# Altium schematic sheet 主控电路.SchDoc
size A4
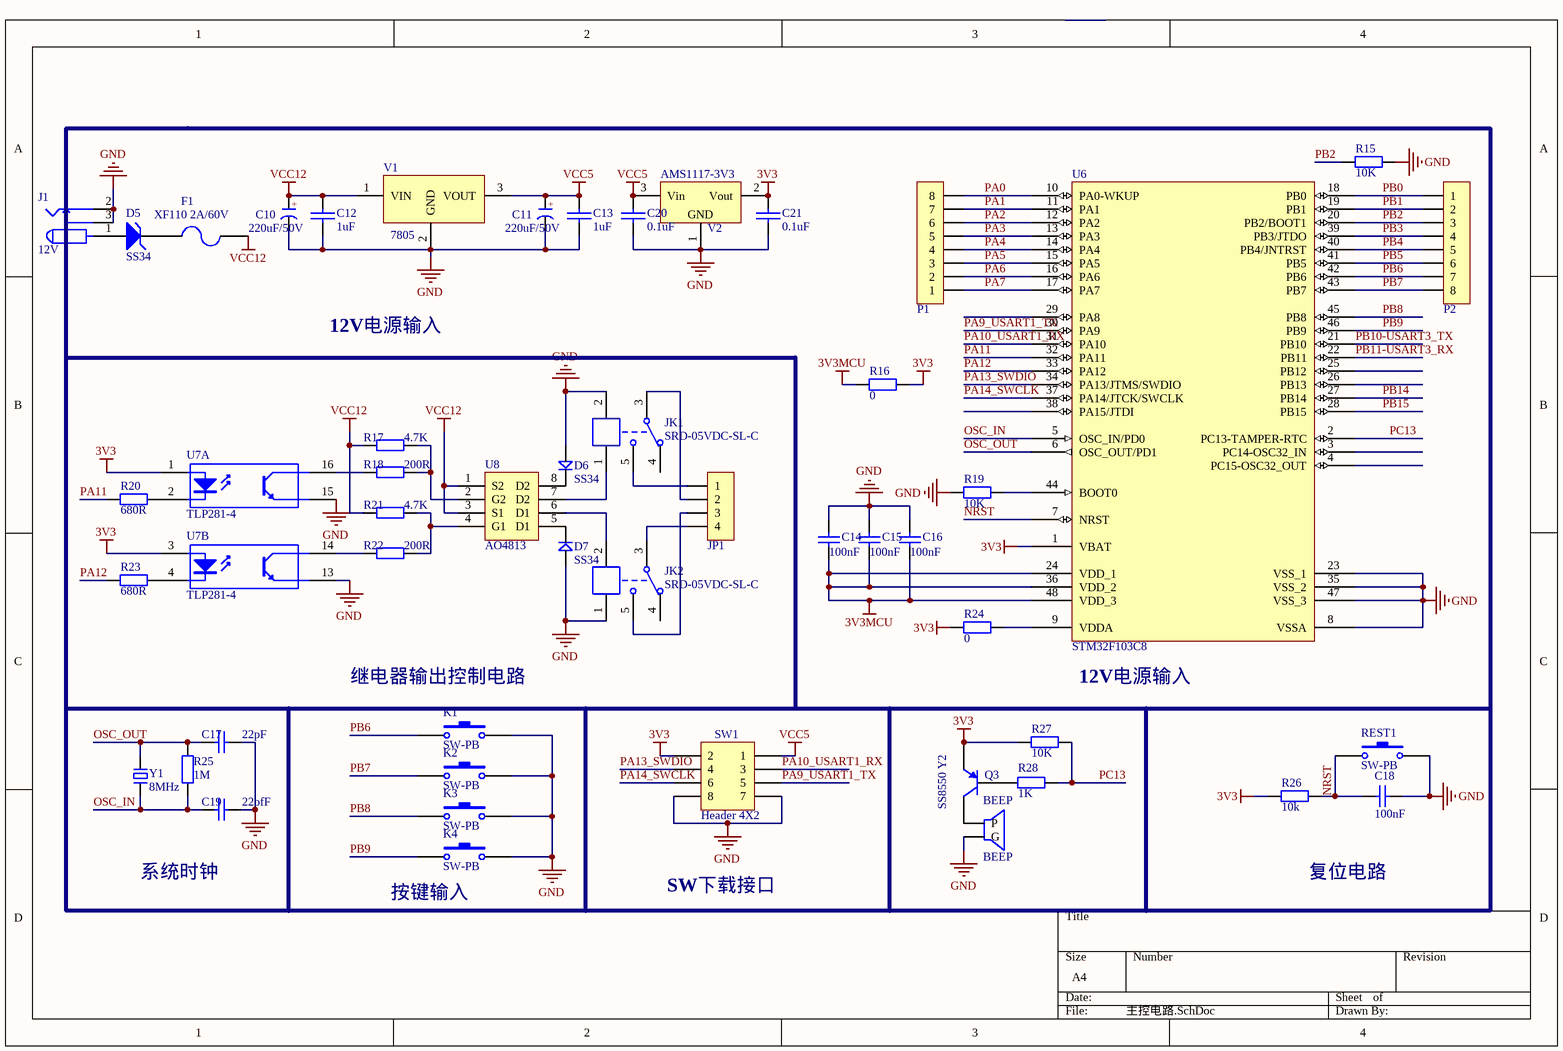
[diagram p0: 主控电路.SchDoc]

## Parts
BEEP  BEEP  [BUZZER]
C10  220uF/50V  [CAP 3.5*8*11.5 - BK]
C11  220uF/50V  [CAP 3.5*8*11.5 - BK]
C12  1uF  [LC-0603_C]
C13  1uF  [LC-0603_C]
C14  100nF  [LC-0603_C]
C15  100nF  [LC-0603_C]
C16  100nF  [LC-0603_C]
C17  22pF  [LC-0603_C]
C18  100nF  [LC-0603_C]
C19  22pfF  [LC-0603_C]
C20  0.1uF  [LC-0603_C]
C21  0.1uF  [LC-0603_C]
D5  SS34  [D1812]
D6  SS34  [D1812]
D7  SS34  [D1812]
F1  XF110 2A/60V  [FUSE1]
J1  12V  [DC10B]
JK1  SRD-05VDC-SL-C  [SRD-C_B]
JK2  SRD-05VDC-SL-C  [SRD-C_B]
JP1  HDR-1X4  [KF128-5.08-4P]  (value not drawn)
K1  SW-PB  [TSW DIP-6*6*5]
K2  SW-PB  [TSW DIP-6*6*5]
K3  SW-PB  [TSW DIP-6*6*5]
K4  SW-PB  [TSW DIP-6*6*5]
P1  HDR-1X8  [HDR2.54-LI-8P]  (value not drawn)
P2  HDR-1X8  [HDR2.54-LI-8P]  (value not drawn)
Q3  SS8550 Y2  [LC-SOT-23(SOT-23-3)]
R15  10K  [LC-0603_R]
R16  0  [LC-0603_R]
R17  4.7K  [LC-0603_R]
R18  200R  [LC-0603_R]
R19  10K  [LC-0603_R]
R20  680R  [LC-0603_R]
R21  4.7K  [LC-0603_R]
R22  200R  [LC-0603_R]
R23  680R  [LC-0603_R]
R24  0  [LC-0603_R]
R25  1M  [LC-0603_R]
R26  10k  [LC-0603_R]
R27  10K  [LC-0603_R]
R28  1K  [LC-0603_R]
REST1  SW-PB  [TSW DIP-6*6*5]
SW1  Header 4X2  [HDR2.54-LI-2x4P]
U6  STM32F103C8  [LQFP48 7X7_M]
U7  TLP281-4  [SOp-16]  (parts A,B of 4)
U8  AO4813  [SOP-8]
V1  7805  [TO220A]
V2  AMS1117-3V3  [SOT223_M]
Y1  8MHz  [OSC HC-49S]

## Nets
3V3: C21.2 Q3.2(E) R16.1 R24.2 R26.1 R27.2 SW1.2 U6.1(VBAT) U7.1(A) U7.3(A) V2.2(Vout)
3V3MCU: C14.1 C15.1 C16.1 R16.2 U6.24(VDD_1) U6.36(VDD_2) U6.48(VDD_3)
GND: BEEP.2(G) C10.2(K) C11.2(K) C12.1 C13.1 C14.2 C15.2 C16.2 C17.2 C18.2 C19.2 C20.1 C21.1 D6.1 D7.1 J1.2 J1.3 JK1.2 JK2.1 K1.2 K2.2 K3.2 K4.2 R15.2 R19.2 REST1.2 SW1.7 SW1.8 U6.8(VSSA) U6.23(VSS_1) U6.35(VSS_2) U6.47(VSS_3) U7.13(E) U7.15(E) V1.2(GND) V2.1(GND)
VCC5: C11.1(A) C13.2 C20.2 SW1.1 V1.3(VOUT) V2.3(Vin)
VCC12: C10.1(A) C12.2 F1.2 R17.2 R21.2 U8.1(S2) U8.3(S1) V1.1(VIN)
NRST: C18.1 R26.2 REST1.1 U6.7(NRST)
OSC_IN: C19.1 R25.1 U6.5(OSC_IN/PD0) Y1.1
OSC_OUT: C17.1 R25.2 U6.6(OSC_OUT/PD1) Y1.2
PA0: P1.8 U6.10(PA0-WKUP)
PA1: P1.7 U6.11(PA1)
PA2: P1.6 U6.12(PA2)
PA3: P1.5 U6.13(PA3)
PA4: P1.4 U6.14(PA4)
PA5: P1.3 U6.15(PA5)
PA6: P1.2 U6.16(PA6)
PA7: P1.1 U6.17(PA7)
PA9_USART1_TX: SW1.5 U6.30(PA9)
PA10_USART1_RX: SW1.3 U6.31(PA10)
PA11: R20.1 U6.32(PA11)
PA12: R23.1 U6.33(PA12)
PA13_SWDIO: SW1.4 U6.34(PA13/JTMS/SWDIO)
PA14_SWCLK: SW1.6 U6.37(PA14/JTCK/SWCLK)
PB0: P2.1 U6.18(PB0)
PB1: P2.2 U6.19(PB1)
PB2: P2.3 R15.1 U6.20(PB2/BOOT1)
PB3: P2.4 U6.39(PB3/JTDO)
PB4: P2.5 U6.40(PB4/JNTRST)
PB5: P2.6 U6.41(PB5)
PB6: K1.1 P2.7 U6.42(PB6)
PB7: K2.1 P2.8 U6.43(PB7)
PB8: K3.1 U6.45(PB8)
PB9: K4.1 U6.46(PB9)
PB10-USART3_TX: U6.21(PB10)
PB11-USART3_RX: U6.22(PB11)
PB14: U6.27(PB14)
PB15: U6.28(PB15)
PC13: R27.1 R28.1 U6.2(PC13-TAMPER-RTC)
NetBEEP_1: BEEP.1(P) Q3.3(C)
NetD5_1: D5.1(A) J1.1
NetD5_2: D5.2(K) F1.1
NetD6_2: D6.2 U8.8(D2)
NetD7_2: D7.2 U8.5(D1)
NetJK1_1: JK1.1 U8.7(D2)
NetJK1_3: JK1.3 JP1.2
NetJK1_5: JK1.5 JP1.1
NetJK2_2: JK2.2 U8.6(D1)
NetJK2_3: JK2.3 JP1.4
NetJK2_5: JK2.5 JP1.3
NetQ3_1: Q3.1(B) R28.2
NetR17_1: R17.1 R18.2 U8.2(G2)
NetR18_1: R18.1 U7.16(C)
NetR19_1: R19.1 U6.44(BOOT0)
NetR20_2: R20.2 U7.2(K)
NetR21_1: R21.1 R22.2 U8.4(G1)
NetR22_1: R22.1 U7.14(C)
NetR23_2: R23.2 U7.4(K)
NetR24_1: R24.1 U6.9(VDDA)

Not connected (* = marked no-connect by the designer): JK1 4; JK2 4; U6 3(PC14-OSC32_IN) 4(PC15-OSC32_OUT) 25(PB12) 26(PB13) 29(PA8) 38(PA15/JTDI)

## Notes on the sheet
- 12V电源输入
- (near K1) 继电器输出控制电路
- 系统时钟
- (near K4) 按键输入
- SW下载接口
- 复位电路
- (in symbol C-CAP) +

## Library data of the parts
C10 C11 = C-CAP: 直插电解电容; 版权归属: 源创客; BOM名称: 直插电解电容; 学习资源: www.ooocke.com
C12 C13 C20 C21 = 0805C: Capacitor 0805
C14-C19 = Cap: 无极性电容; Published: 8-Jun-2000; LatestRevisionDate: 17-Jul-2002; LatestRevisionNote: Re-released for DXP Platform.; PackageReference: RAD-0.3; Publisher: Altium Limited
D5 = 1N5822: Zener Diode
D6 D7 = D
F1 = FUSE2: Fuse
J1 = POW
JK1 JK2 = SRD-05VDC-SL-C: 5V一组转换; BOM名称: 5V继电器; 版权归属: 源创客; 学习资源: www.ooocke.com
JP1 = Header 4: 4P接插件; 版权归属: 源创客; BOM名称: 4P接插件; 学习资源: www.ooocke.com
K1-K4 REST1 = SW-PB: Switch; Published: 24-Mar-1999; LatestRevisionDate: 17-Jul-2002; LatestRevisionNote: Re-released for DXP Platform.; PackageReference: SPST-2; Publisher: Altium Limited; PackageDescription: Switch; 2 Leads
P1 P2 = Header 8: 8P接插件; 版权归属: 源创客; BOM名称: 8P接插件; 学习资源: www.ooocke.com
Q3 = SOT-23 SS8550 Y2: 三极管; ComponentLink1Description: 供应商链接; ComponentLink1URL: http://www.szlcsc.com/product/details_9037.html; Package: SOT-23; Supplier: LC; SuppliersPartNumber: C8542
R15 R16 R19 R24-R26 = Res1: 贴片电阻; Value: 1K; Published: 8-Jun-2000; LatestRevisionDate: 17-Jul-2002; LatestRevisionNote: Re-released for DXP Platform.; PackageReference: AXIAL-0.4; Publisher: Altium Limited
R17 R18 R20-R23 = 0603 2.7KΩ (2701) 1%: 贴片电阻; ComponentLink1Description: 供应商链接; ComponentLink1URL: http://www.szlcsc.com/product/details_13814.html; Package: 0603; Supplier: LC; SuppliersPartNumber: C13167
R27 R28 = 0603 1.1KΩ (1101) 1%: 贴片电阻; ComponentLink1Description: 供应商链接; ComponentLink1URL: http://www.szlcsc.com/product/details_23491.html; Package: 0603; Supplier: LC; SuppliersPartNumber: C22764
SW1 = Header 4X2: Header, 4-Pin, Dual row; LatestRevisionDate: 17-Jul-2002; LatestRevisionNote: Re-released for DXP Platform.; Publisher: Altium Limited
U6 = STM32F103C8: Flaah:64/RAM:20/IO:36; BOM名称: 32位STM单片机; 版权归属: 源创客; 学习资源: www.ooocke.com
U7 = TP521-4_1
U8 = NDS8434
V1 = 78xx: 线性稳压芯片; 版权归属: 源创客; BOM名称: 线性稳压芯片; 学习资源: www.ooocke.com
V2 = AMS1117: 三端稳压芯片; BOM名称: 稳压芯片; 版权归属: 源创客; 学习资源: www.ooocke.com
Y1 = XTAL-2P: 2脚无源脚晶振; 版权归属: 源创客; BOM名称: 2脚无源脚晶振; 学习资源: www.ooocke.com